# EAGLE design FetherV2 (EAGLE 9.6.2)
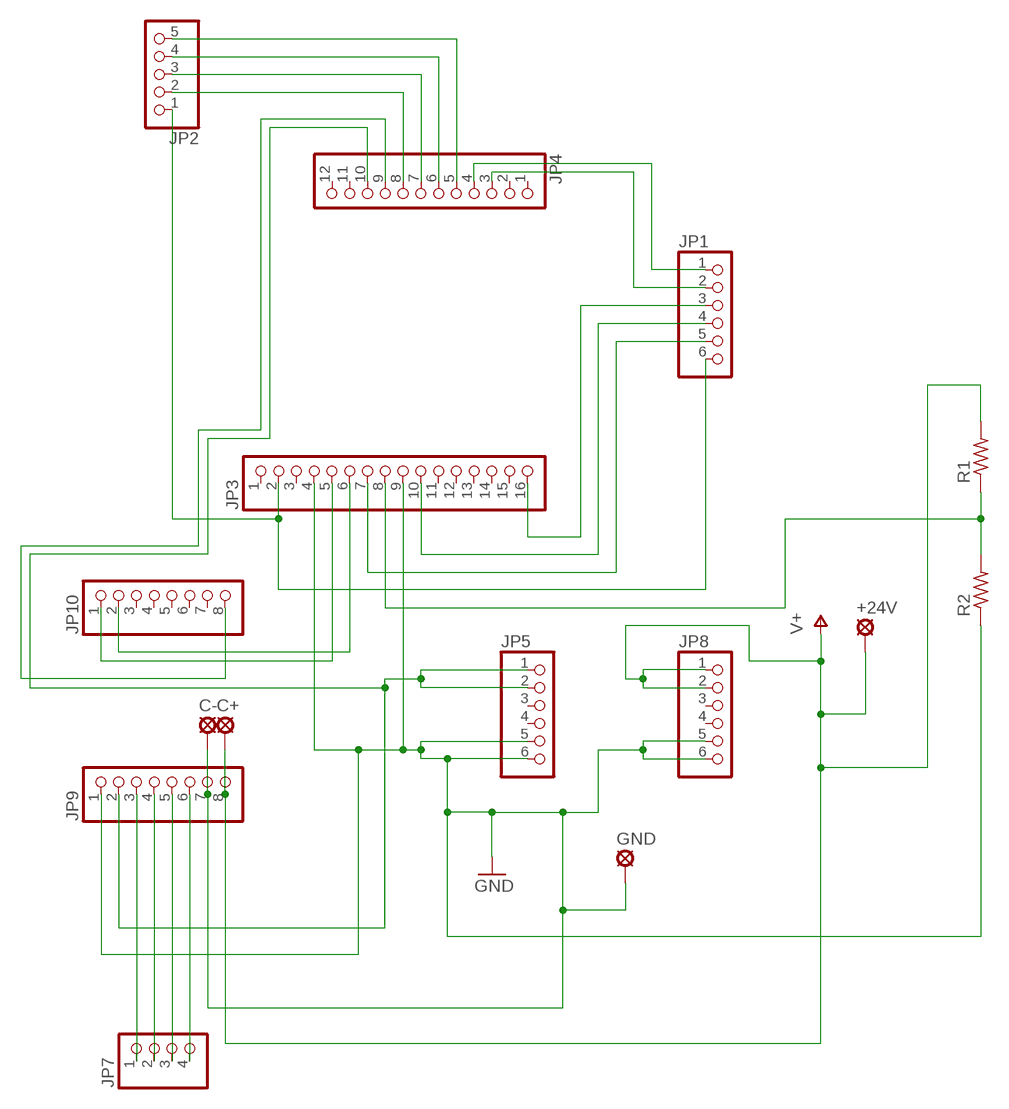
[diagram p0: schematic, sheet 1]

## Parts
+24V  SE14  [SE14]
C+  SE14  [SE14]
C-  SE14  [SE14]
GND  SE14  [SE14]
JP1  PINHD-1X6/90  [1X06/90]
JP2  PINHD-1X5/90  [1X05/90]
JP3  PINHD-1X16  [1X16]
JP4  PINHD-1X12  [1X12]
JP5  PINHD-1X6  [1X06]
JP7  PINHD-1X4  [1X04]
JP8  PINHD-1X6  [1X06]
JP9  PINHD-1X8  [1X08]
JP10  PINHD-1X8  [1X08]
R1  FLIPFLOP-RES  [0805-THM]
R2  FLIPFLOP-RES  [0805-THM]

## Nets
GND: C-.MP GND.MP JP3.4 JP3.9 JP5.5 JP5.6 JP8.5 JP8.6 JP9.1 JP9.7 R2.1
N$1: JP2.2 JP4.8
N$2: JP2.3 JP4.7
N$3: JP2.4 JP4.6
N$4: JP2.5 JP4.5
N$5: JP1.1 JP4.4
N$6: JP1.2 JP4.3
N$7: JP7.1 JP9.3
N$8: JP1.3 JP3.16
N$9: JP1.4 JP3.10
N$10: JP1.5 JP3.7
N$11: JP1.6 JP2.1 JP3.2
N$12: JP4.10 JP5.1 JP5.2 JP9.2
N$13: JP7.2 JP9.4
N$14: JP7.3 JP9.5
N$15: JP7.4 JP9.6
N$16: JP3.5 JP10.1
N$17: JP4.9 JP10.8
N$18: JP3.6 JP10.2
N$20: JP3.8 R1.1 R2.2
V+: +24V.MP C+.MP JP8.1 JP8.2 JP9.8 R1.2
Unconnected: JP3.1 JP3.3 JP3.11 JP3.12 JP3.13 JP3.14 JP3.15 JP4.1 JP4.2 JP4.11 JP4.12 JP5.3 JP5.4 JP8.3 JP8.4 JP10.3 JP10.4 JP10.5 JP10.6 JP10.7

## Library data of the parts
+24V C+ C- GND = solpad:SE14: SOLDER PAD E1553, drill 1,4mm, distributor Buerklin, 07F820
JP1 JP5 JP8 = pinhead:PINHD-1X6: PIN HEADER
JP2 = pinhead:PINHD-1X5: PIN HEADER
JP3 = pinhead:PINHD-1X16: PIN HEADER
JP4 = pinhead:PINHD-1X12: PIN HEADER
JP7 = pinhead:PINHD-1X4: PIN HEADER
JP9 JP10 = pinhead:PINHD-1X8: PIN HEADER
R1 R2 = adafruit:FLIPFLOP-RES: Flip Flop resistor An 0805 resistor inside a standard 1/4W 5% resistor. Makes for easy mods

## Board
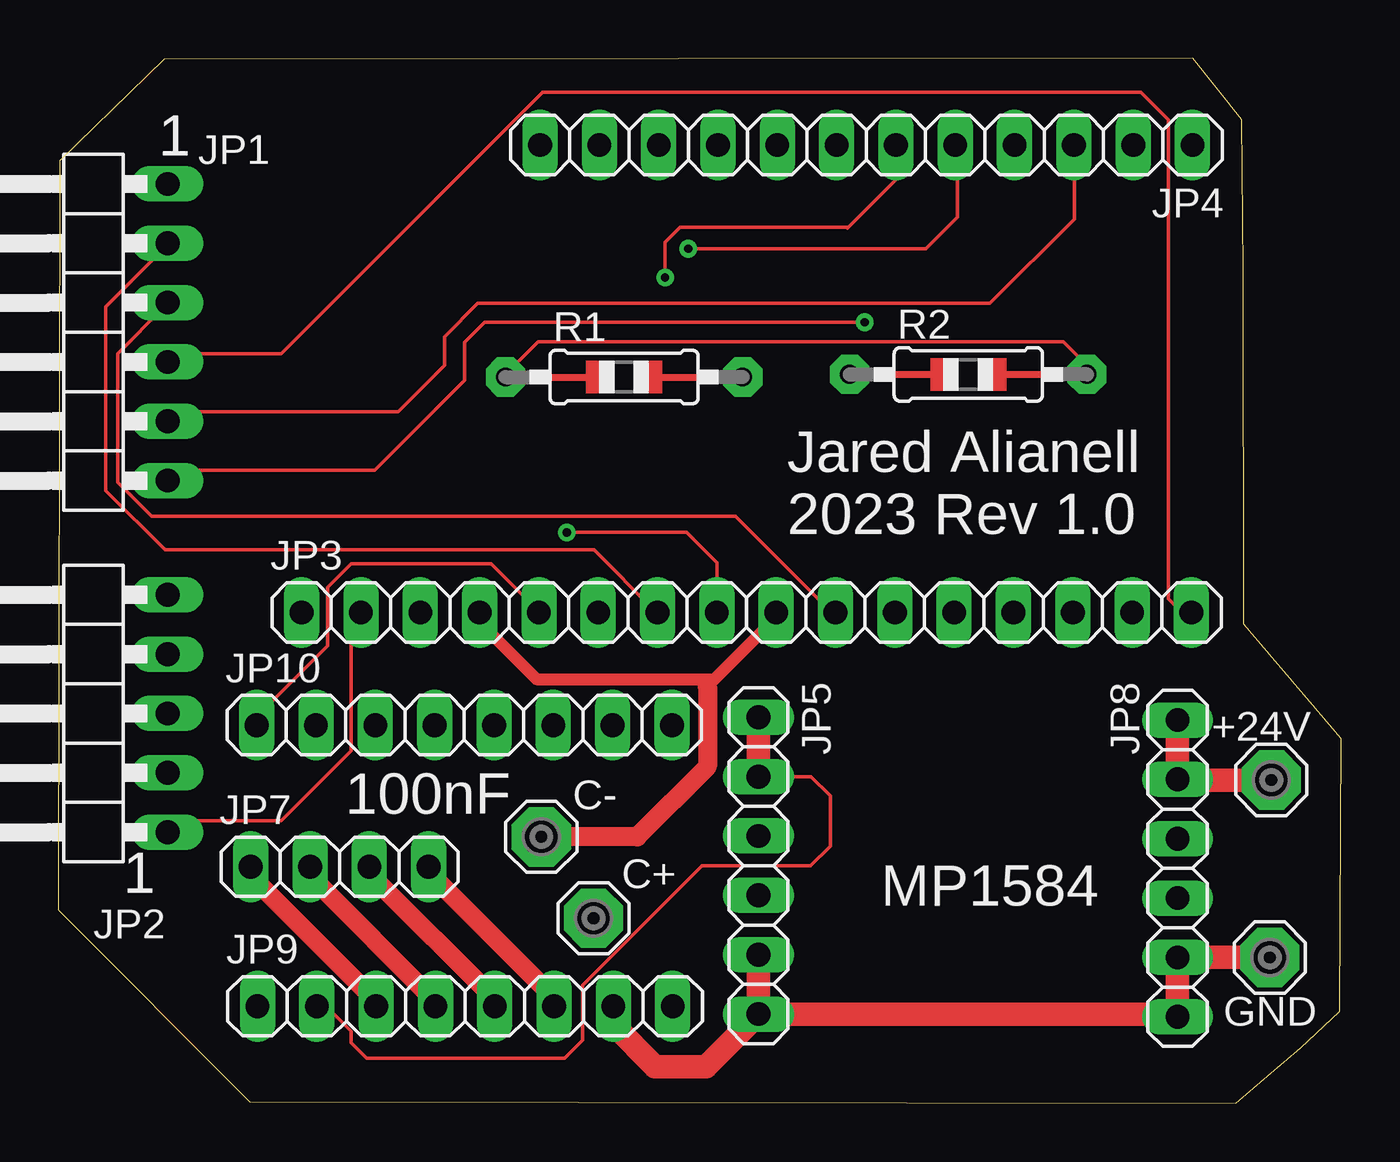
[diagram p1: board, top side]
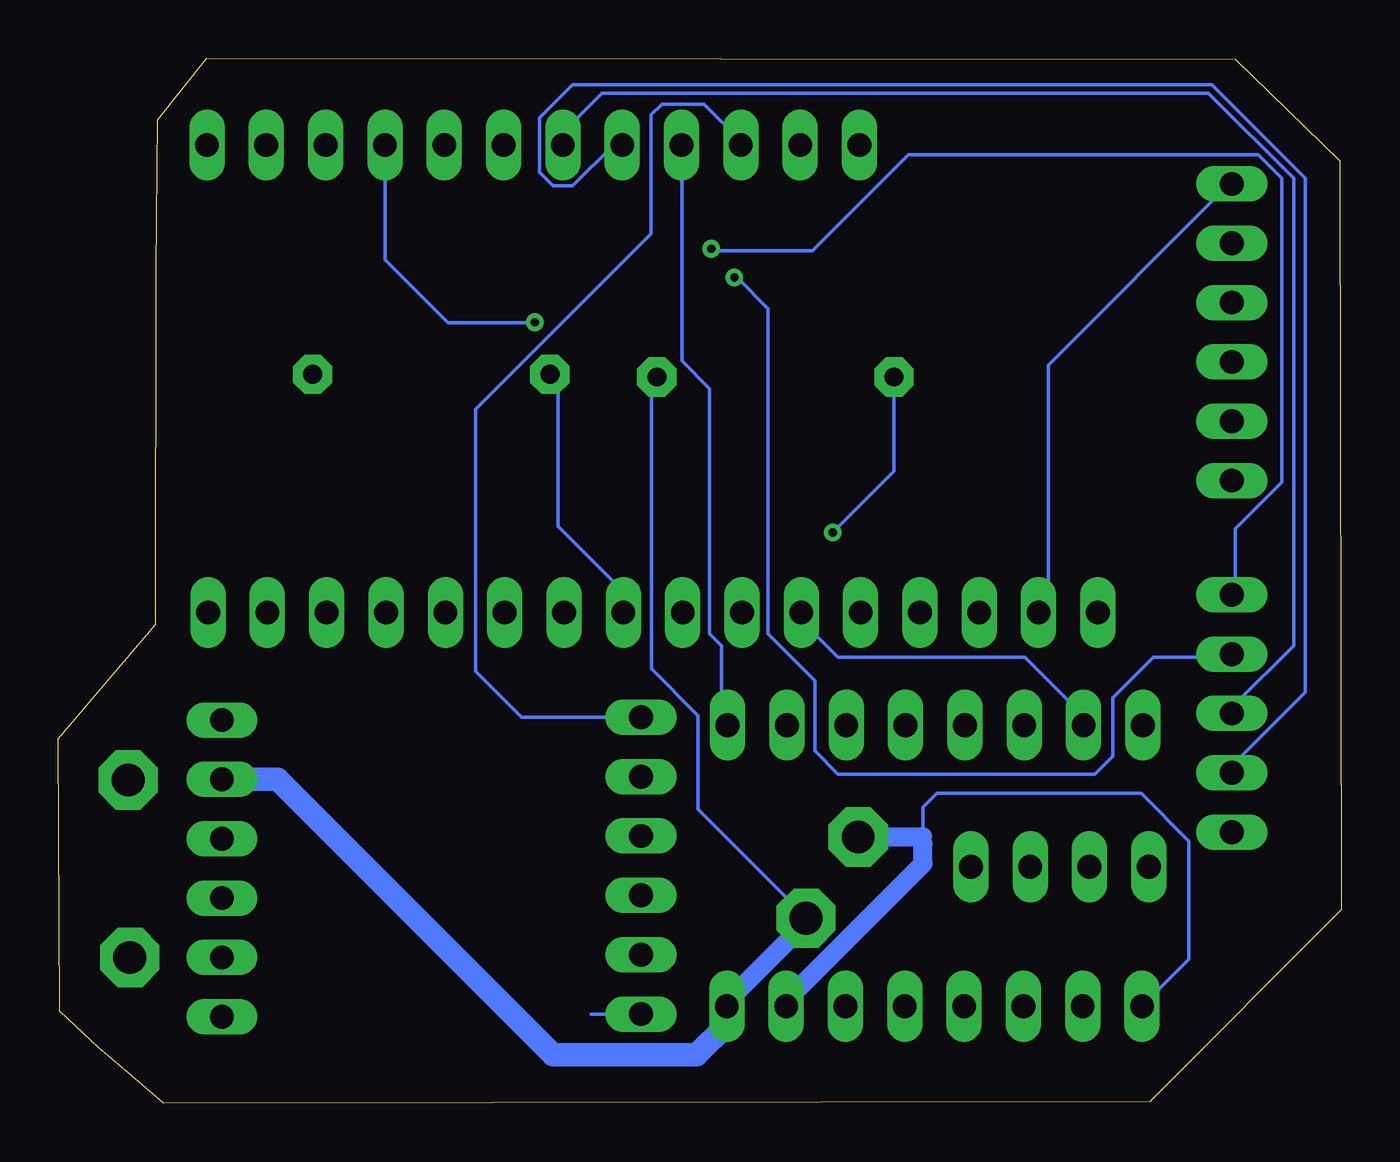
[diagram p2: board, bottom side, seen from below]

Size 54.93 x 44.72 mm. Coordinates in mm from the lower left corner, seen from the top.
Outline: 48.57,44.72 4.54,44.69 0.06,40.33 0,8.27 8.19,0.06 50.42,0 51.79,1.17 53.2,2.38 54.88,3.93 54.93,15.6 50.76,20.51 50.74,35.66 50.68,42.09 48.57,44.72
Copper layers (1*16): Top 0.035mm / dielectric 1.5mm / Bottom 0.035mm
Design rules "default": minimum track width 6mil, minimum drill 0.35mm, track to track 6mil, track to pad 6mil, pad to pad 6mil, via to via 6mil, smd to smd 6mil, copper to edge 40mil, drill to drill 6mil, minimum pad ring 10mil, minimum via ring 8mil, stop-mask expansion 4mil, vias tented up to drill 0mil, thermal gap 10mil

### Footprints (pad centres in the part's own frame; a part is rotated, then mirrored left to right if it is on the bottom)
SE14 = drill 1.397 pad 2.54 octagon: MP 0,0
1X06/90 = drill 1.016 long: 1 -6.35,-3.81; 2 -3.81,-3.81; 3 -1.27,-3.81; 4 1.27,-3.81; 5 3.81,-3.81; 6 6.35,-3.81
1X05/90 = drill 1.016 long: 1 -5.08,-3.81; 2 -2.54,-3.81; 3 0,-3.81; 4 2.54,-3.81; 5 5.08,-3.81
1X16 = drill 1.016 long: 1 -19.05,0; 2 -16.51,0; 3 -13.97,0; 4 -11.43,0; 5 -8.89,0; 6 -6.35,0; 7 -3.81,0; 8 -1.27,0; 9 1.27,0; 10 3.81,0; 11 6.35,0; 12 8.89,0; 13 11.43,0; 14 13.97,0; 15 16.51,0; 16 19.05,0
1X12 = drill 1.016 long: 1 -13.97,0; 2 -11.43,0; 3 -8.89,0; 4 -6.35,0; 5 -3.81,0; 6 -1.27,0; 7 1.27,0; 8 3.81,0; 9 6.35,0; 10 8.89,0; 11 11.43,0; 12 13.97,0
1X06 = drill 1.016 long: 1 -6.35,0; 2 -3.81,0; 3 -1.27,0; 4 1.27,0; 5 3.81,0; 6 6.35,0
1X04 = drill 1.016 long: 1 -3.81,0; 2 -1.27,0; 3 1.27,0; 4 3.81,0
1X08 = drill 1.016 long: 1 -8.89,0; 2 -6.35,0; 3 -3.81,0; 4 -1.27,0; 5 1.27,0; 6 3.81,0; 7 6.35,0; 8 8.89,0
0805-THM = drill 0.813 pad 1.676 octagon: 1 -5.08,0; 2 5.08,0

### Placement (x,y rotation side)
+24V  51.94,13.83 0 top
C+  22.91,7.92 0 top
C-  20.68,11.4 0 top
GND  51.87,6.23 0 top
JP1  0.87,33 90 top
JP2  0.87,16.68 90 top
JP3  29.47,21.01 0 top
JP4  34.59,41.01 180 top
JP5  29.98,10.16 270 top
JP7  12.04,10.12 0 top
JP8  47.92,10.05 270 top
JP9  17.41,4.15 0 top
JP10  17.38,16.18 0 top
R1  24.22,31.08 0 top
R2  38.96,31.19 0 top

### Tracks (layer width: path | path; a pad name or v marks a point on that pad's centre or on a via)
GND
  Top 0.152: 18.04,20.59 JP3.4 | 30.54,20.59 JP3.9 | 21.04,11.59 C-.MP | 23.76,4.66 JP9.7 23.76,3.35 | 29.9,6.43 JP5.5 | 47.8,3.81 JP8.6 | JP8.5 | 28.1,18.15 28.4,18.45 | 28.4,18.45
  Top 0.508: 18.04,20.59 20.47,18.15 28.1,18.15 | 27.79,17.84 28.4,18.45 30.54,20.59
  Top 0.813: C-.MP 24.79,11.4 27.79,14.4 27.79,17.84
  Top 1.016: JP5.5 JP5.6 | JP8.6 JP8.5 | 23.76,3.35 25.55,1.56 27.73,1.56 JP5.6 | JP5.6 47.8,3.81 | GND.MP JP8.5
  Bottom 0.152: 20.54,11.09 C-.MP | 23.51,4.64 JP9.7 | R2.1 33.54,31.09 33.54,24.7 30.1,21.26 JP3.9 | 17.91,11.41 17.91,11.1 17.9,11.09 | 17.9,11.41 17.9,12.67 17.3,13.27 8.56,13.27 6.51,11.22 6.51,6.16 JP9.1 | JP5.6 32.11,3.81
  Bottom 0.813: 23.51,4.64 17.9,10.25 17.9,11.09 | C-.MP 20.66,11.41 17.91,11.41
N$1
  Bottom 0.152: JP2.2 4.54,14.59 1.54,17.59 1.54,39.59 5.54,43.59 26.29,43.59 26.48,43.59 32.91,43.59 34.32,42.18 34.32,39.84 33.74,39.26 32.91,39.26 31.16,41.01 JP4.8
N$2
  Bottom 0.152: JP2.3 4.54,17.09 2.04,19.59 2.04,39.59 5.68,43.23 31.65,43.23 33.33,41.55 JP4.7
N$3  (via drill 0.35)
  Top 0.152: v25.98,35.34 25.98,36.86 26.61,37.49 33.76,37.49 33.79,37.46 35.87,39.53 JP4.6
  Bottom 0.152: JP2.4 5.04,19.09 8.04,19.09 9.77,17.36 9.77,14.86 10.54,14.09 21.54,14.09 22.54,15.09 22.54,18.09 24.54,20.09 24.54,34 25.87,35.34 v25.98,35.34
N$4  (via drill 0.35)
  Top 0.152: v26.97,36.57 37.15,36.57 38.5,37.92 38.5,40.91 JP4.5
  Bottom 0.152: JP2.5 4.54,22.09 4.54,24.59 2.54,26.59 2.54,39.59 3.54,40.59 18.54,40.59 22.64,36.48 26.89,36.48 v26.97,36.57
N$5  (via drill 0.35)
  Top 0.152: JP1.1 5.04,27.09 13.54,27.09 17.39,30.94 17.39,32.56 18.24,33.42 34.38,33.42 v34.52,33.42
  Bottom 0.152: v34.52,33.42 34.55,33.4 38.24,33.4 40.95,36.1 JP4.4
N$6
  Top 0.152: JP1.2 5.04,29.59 14.54,29.59 16.53,31.58 16.53,32.81 17.95,34.24 39.89,34.24 43.5,37.84 JP4.3
N$7
  Top 0.152: 13.71,4.26 JP9.3
  Top 0.813: 13.71,4.26 8.24,9.73 JP7.1
N$8
  Top 0.152: JP1.3 5.04,32.09 9.54,32.09 20.73,43.28 46.35,43.28 47.54,42.09 47.54,21.59 48.04,21.09 JP3.16
N$9
  Top 0.152: JP1.4 4.54,34.09 2.54,32.09 2.54,26.59 4,25.12 29,25.12 33.04,21.09 JP3.10
N$10
  Top 0.152: JP1.5 4.54,36.59 2.04,34.09 2.04,26.22 4.57,23.68 22.94,23.68 25.54,21.09 JP3.7
N$11
  Top 0.152: JP2.1 5.04,12.09 9.54,12.09 12.54,15.09 12.54,20.59 JP3.2
  Bottom 0.152: JP1.6 5.04,39.09 12.54,31.59 12.54,21.09 JP3.2
N$12
  Top 0.152: JP9.2 11.54,4.09 12.54,3.09 12.54,2.59 13.21,1.92 21.68,1.92 22.45,2.69 22.45,5.04 27.57,10.16 32.21,10.16 33.06,11.01 33.06,13.15 32.24,13.97 JP5.2
  Top 1.016: JP5.2 JP5.1
  Bottom 0.152: JP4.10 25.71,41.18 27.28,42.76 29.08,42.76 29.54,42.31 29.54,37.21 37.06,29.69 37.06,18.48 35.1,16.51 JP5.1
N$13
  Top 0.152: 16.25,4.26 JP9.4
  Top 0.813: 16.25,4.26 10.78,9.73 JP7.2
N$14
  Top 0.152: 18.82,4.32 JP9.5
  Top 0.813: 18.82,4.32 13.32,9.83 JP7.3
N$15
  Top 0.152: 21.38,4.36 JP9.6
  Top 0.813: 21.38,4.36 15.86,9.88 JP7.4
N$16
  Top 0.152: JP10.1 8.54,16.59 11.54,19.59 11.54,22.09 12.54,23.09 18.54,23.09 20.54,21.09 JP3.5
N$17
  Bottom 0.152: 28.22,39.87 28.22,39.42 | 28.22,39.42 28.22,31.77 27.04,30.59 27.04,20.09 26.54,19.59 26.54,16.59 JP10.8 | JP4.9 28.25,39.45 28.22,39.42
N$18
  Bottom 0.152: JP10.2 11.04,16.59 13.54,19.09 21.54,19.09 23.04,20.59 JP3.6
N$20  (via drill 0.35)
  Top 0.152: R1.1 19.04,31.09 20.54,32.59 43.04,32.59 44.04,31.59 R2.2 | JP3.8 28.2,23.14 26.9,24.44 21.78,24.44 v21.77,24.43
  Bottom 0.152: v21.77,24.43 19.14,27.05 R1.1
V+
  Top 0.152: 47.95,13.83 JP8.2
  Top 1.016: +24V.MP 47.95,13.83 | JP8.1 JP8.2
  Bottom 0.152: 26.04,4.59 JP9.8 | 23.04,7.59 C+.MP 23.04,8.09 27.54,12.59 27.54,16.59 29.54,18.59 29.54,30.59 R1.2
  Bottom 0.813: 23.04,7.59 26.04,4.59 | JP9.8 26.3,3.36
  Bottom 1.016: 26.3,3.36 27.6,2.06 33.75,2.06 45.54,13.86 JP8.2

### Text on the board
tNames: 1 | Jared Alianell / 2023 Rev 1.0 | 100nF | 1 | MP1584